# EAGLE design input_wheel (EAGLE 7.3.0)
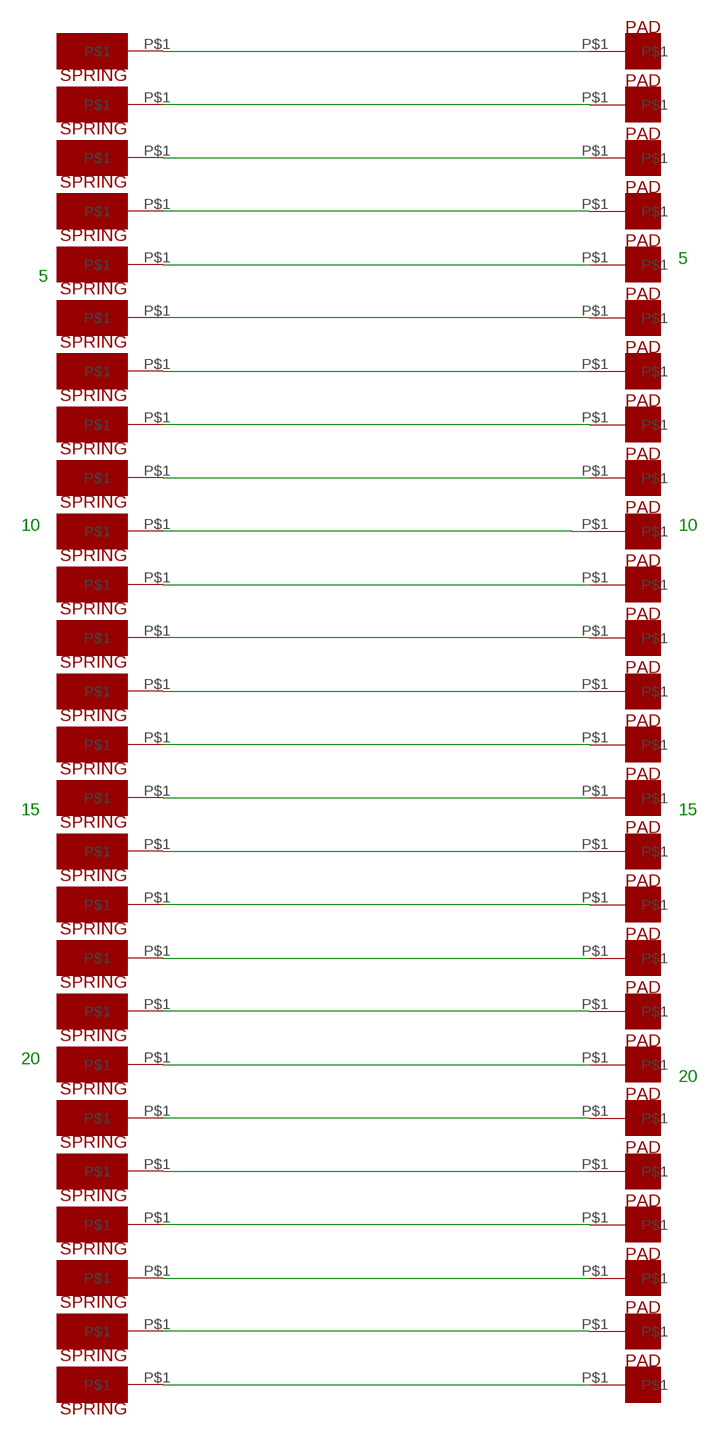
[diagram p0: schematic, sheet 1]

## Parts
U$1  CONTACT  [CONTACT]
U$2  CONTACT  [CONTACT]
U$3  CONTACT  [CONTACT]
U$4  CONTACT  [CONTACT]
U$5  CONTACT  [CONTACT]
U$6  CONTACT  [CONTACT]
U$7  CONTACT  [CONTACT]
U$8  CONTACT  [CONTACT]
U$9  CONTACT  [CONTACT]
U$10  CONTACT  [CONTACT]
U$11  CONTACT  [CONTACT]
U$12  CONTACT  [CONTACT]
U$13  CONTACT  [CONTACT]
U$14  CONTACT  [CONTACT]
U$15  CONTACT  [CONTACT]
U$16  CONTACT  [CONTACT]
U$17  CONTACT  [CONTACT]
U$18  CONTACT  [CONTACT]
U$19  CONTACT  [CONTACT]
U$20  CONTACT  [CONTACT]
U$21  CONTACT  [CONTACT]
U$22  CONTACT  [CONTACT]
U$23  CONTACT  [CONTACT]
U$24  CONTACT  [CONTACT]
U$25  CONTACT  [CONTACT]
U$26  CONTACT  [CONTACT]
U$27  SPRING  [SPRING]
U$28  SPRING  [SPRING]
U$29  SPRING  [SPRING]
U$30  SPRING  [SPRING]
U$31  SPRING  [SPRING]
U$32  SPRING  [SPRING]
U$33  SPRING  [SPRING]
U$34  SPRING  [SPRING]
U$35  SPRING  [SPRING]
U$36  SPRING  [SPRING]
U$37  SPRING  [SPRING]
U$38  SPRING  [SPRING]
U$39  SPRING  [SPRING]
U$40  SPRING  [SPRING]
U$41  SPRING  [SPRING]
U$42  SPRING  [SPRING]
U$43  SPRING  [SPRING]
U$44  SPRING  [SPRING]
U$45  SPRING  [SPRING]
U$46  SPRING  [SPRING]
U$47  SPRING  [SPRING]
U$48  SPRING  [SPRING]
U$49  SPRING  [SPRING]
U$50  SPRING  [SPRING]
U$51  SPRING  [SPRING]
U$52  SPRING  [SPRING]

## Nets
N$1: U$10.P$1 U$36.P$1
N$2: U$1.P$1 U$27.P$1
N$3: U$2.P$1 U$28.P$1
N$4: U$4.P$1 U$30.P$1
N$5: U$11.P$1 U$37.P$1
N$6: U$5.P$1 U$31.P$1
N$7: U$6.P$1 U$32.P$1
N$8: U$7.P$1 U$33.P$1
N$9: U$8.P$1 U$34.P$1
N$10: U$9.P$1 U$35.P$1
N$11: U$12.P$1 U$38.P$1
N$12: U$13.P$1 U$39.P$1
N$13: U$14.P$1 U$40.P$1
N$14: U$15.P$1 U$41.P$1
N$15: U$16.P$1 U$42.P$1
N$16: U$17.P$1 U$43.P$1
N$17: U$18.P$1 U$44.P$1
N$18: U$19.P$1 U$45.P$1
N$19: U$20.P$1 U$46.P$1
N$20: U$21.P$1 U$47.P$1
N$21: U$22.P$1 U$48.P$1
N$22: U$23.P$1 U$49.P$1
N$23: U$24.P$1 U$50.P$1
N$24: U$25.P$1 U$51.P$1
N$25: U$26.P$1 U$52.P$1
N$27: U$3.P$1 U$29.P$1

## Notes on the sheet
- 5
- 5
- 10 | 10
- 15 | 15
- 20
- 20

## Library data of the parts
U$1-U$26 = enigma:CONTACT
U$27-U$52 = enigma:SPRING

## Board
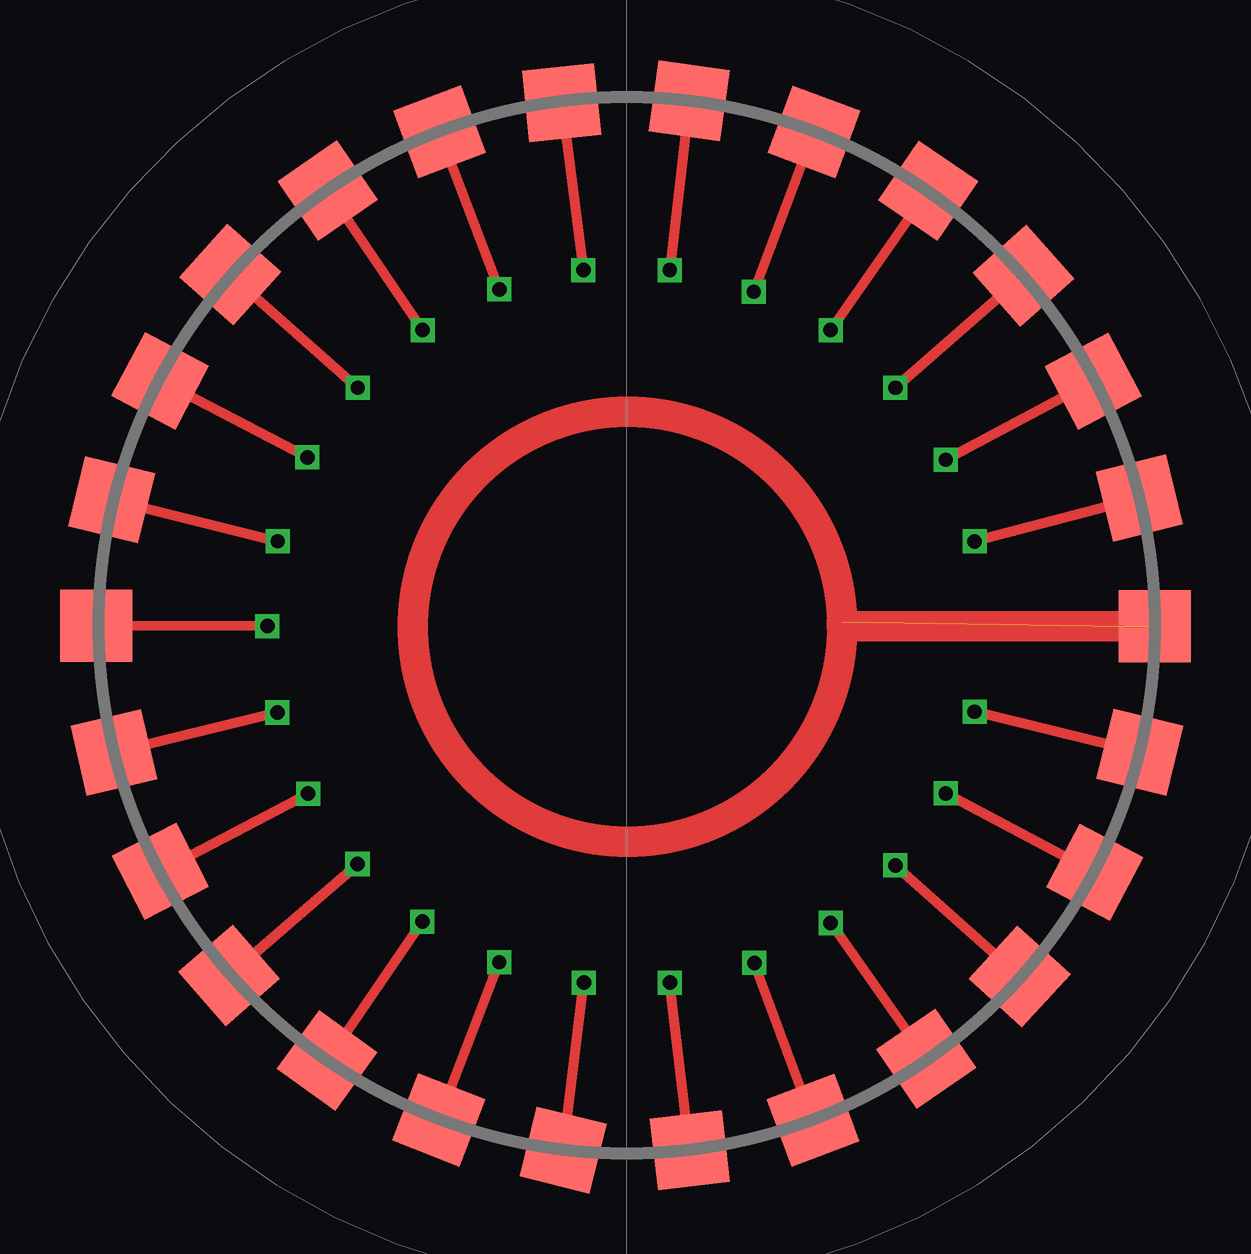
[diagram p1: board, top side]
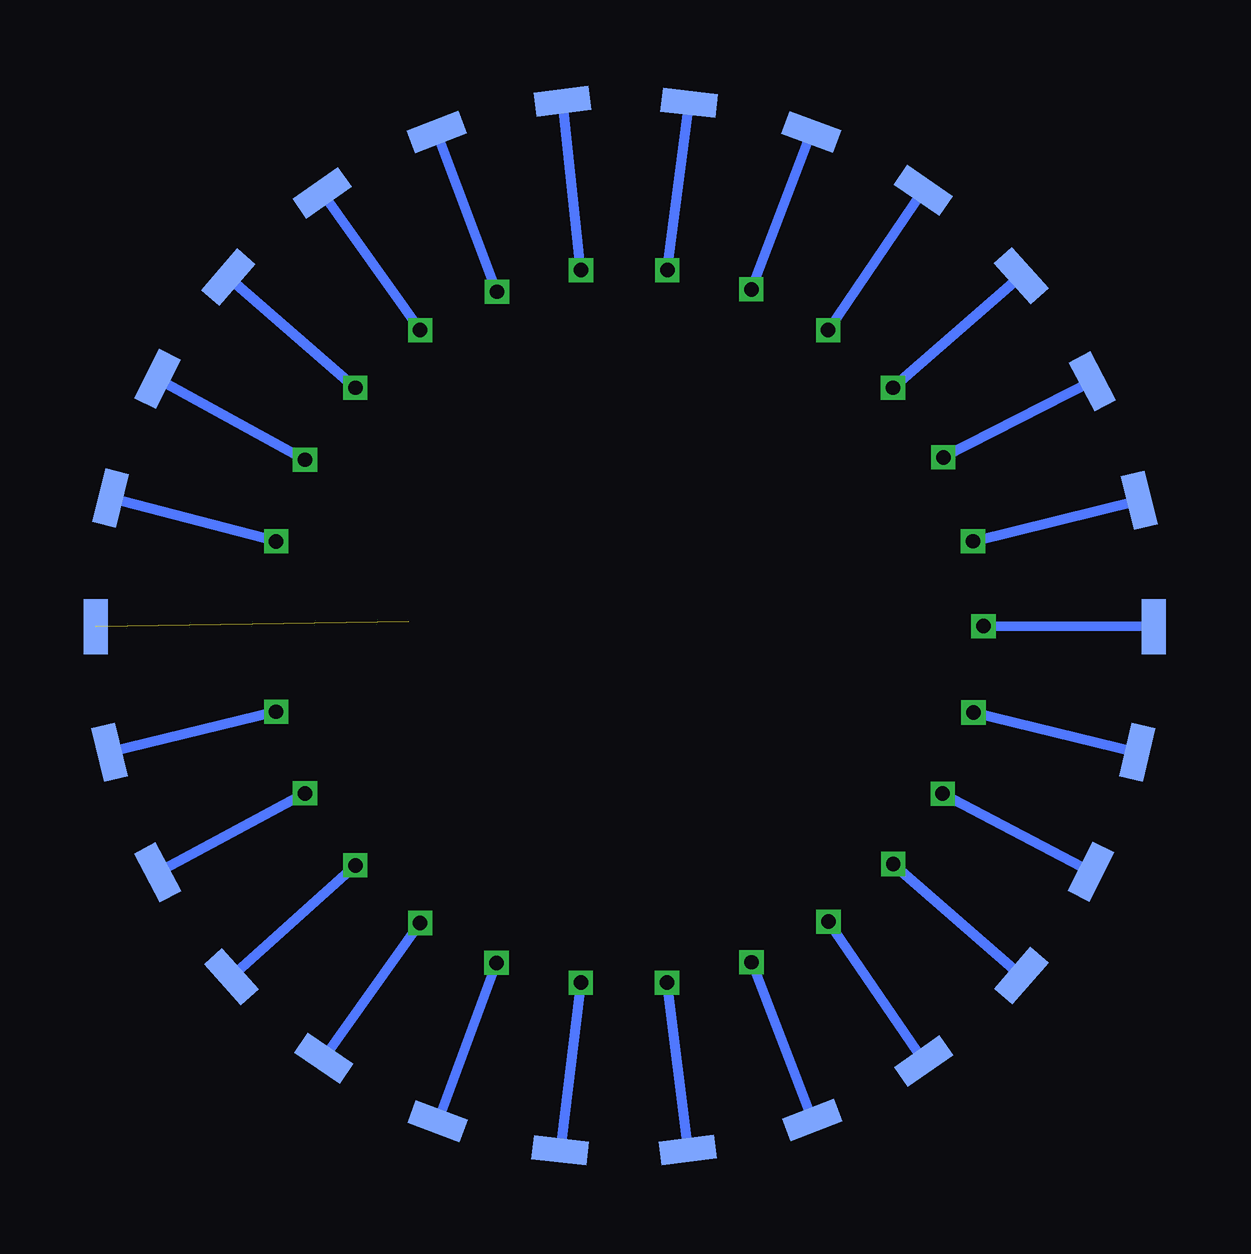
[diagram p2: board, bottom side, seen from below]

No outline drawn. Coordinates in mm, seen from the top.
Copper layers (1*16): Top 0.035mm / dielectric 1.5mm / Bottom 0.035mm
Design rules "default": minimum track width 10mil, minimum drill 24mil, track to track 8mil, track to pad 8mil, pad to pad 8mil, via to via 8mil, smd to smd 8mil, copper to edge 40mil, drill to drill 8mil, minimum pad ring 10mil, minimum via ring 8mil, stop-mask expansion 4mil, vias tented up to drill 0mil, thermal gap 10mil

### Footprints (pad centres in the part's own frame; a part is rotated, then mirrored left to right if it is on the bottom)
CONTACT = smd 3 x 3: P$1 0,0
SPRING = smd 2.3 x 1: P$1 0,0

### Placement (x,y rotation side)
U$1  52.01,29.97 0 top
U$2  51.36,35.31 103.9 top
U$3  49.44,40.18 117.8 top
U$4  46.53,44.57 41.7 top
U$5  42.56,48.11 145.6 top
U$6  37.8,50.56 69.5 top
U$7  7.89,29.98 0 top
U$8  27.29,51.77 95.9 top
U$9  49.51,19.71 332.2 top
U$10  51.38,24.71 346.1 top
U$11  46.38,15.37 137.6 top
U$12  42.48,11.95 304.4 top
U$13  32.64,8.13 276.6 top
U$14  37.77,9.38 290.5 top
U$15  22.17,9.39 248.8 top
U$16  27.36,8.14 346.1 top
U$17  13.44,15.42 221 top
U$18  17.53,11.87 54.2 top
U$19  17.54,48.12 304.4 top
U$20  22.2,50.57 290.5 top
U$21  13.48,44.62 318.3 top
U$22  10.56,40.19 332.2 top
U$23  8.63,24.71 193.2 top
U$24  8.54,35.23 346.1 top
U$25  10.57,19.76 207.1 top
U$26  32.61,51.86 82 top
U$27  52.02,29.95 90 bottom
U$28  51.39,35.31 76.1 bottom
U$29  49.45,40.27 242.9 bottom
U$30  46.5,44.51 229 bottom
U$31  42.59,48.02 215.1 bottom
U$32  37.81,50.56 201.2 bottom
U$33  7.94,29.94 90 bottom
U$34  27.3,51.77 353.4 bottom
U$35  49.44,19.71 117.8 bottom
U$36  51.45,24.71 103.9 bottom
U$37  46.37,15.36 131.7 bottom
U$38  42.52,11.96 145.6 bottom
U$39  32.67,8.13 173.4 bottom
U$40  37.78,9.34 159.5 bottom
U$41  22.16,9.39 201.2 bottom
U$42  27.35,8.14 187.3 bottom
U$43  13.45,15.41 229 bottom
U$44  17.53,11.85 215.1 bottom
U$45  17.54,48.12 145.6 bottom
U$46  22.21,50.56 159.5 bottom
U$47  13.46,44.57 131.7 bottom
U$48  10.5,40.17 117.8 bottom
U$49  8.62,24.71 256.8 bottom
U$50  8.54,35.22 103.9 bottom
U$51  10.55,19.74 242.9 bottom
U$52  32.57,51.84 187.3 bottom

### Tracks (layer width: path | path; a pad name or v marks a point on that pad's centre or on a via)
N$1  (via drill 0.6)
  Top 0.406: U$10.P$1 v44.5,26.4
  Bottom 0.406: v44.5,26.4 U$36.P$1
N$2  (2 unrouted)
  Top 1.27: U$1.P$1 38.97,29.97 38.97,30.15
N$3  (via drill 0.6)
  Top 0.406: U$2.P$1 v44.5,33.5
  Bottom 0.406: v44.5,33.5 U$28.P$1
N$4  (via drill 0.6)
  Top 0.406: v41.2,39.9 U$4.P$1
  Bottom 0.406: U$30.P$1 v41.2,39.9
N$5  (via drill 0.6)
  Top 0.406: U$11.P$1 v41.2,20
  Bottom 0.406: v41.2,20 U$37.P$1
N$6  (via drill 0.6)
  Top 0.406: v38.5,42.3 U$5.P$1
  Bottom 0.406: U$31.P$1 v38.5,42.3
N$7  (via drill 0.6)
  Top 0.406: U$6.P$1 v35.3,43.9
  Bottom 0.406: v35.3,43.9 U$32.P$1
N$8  (via drill 0.6)
  Top 0.406: v15.03,29.97 U$7.P$1
  Bottom 0.406: U$33.P$1 v15.03,29.97
N$9  (via drill 0.6)
  Top 0.406: U$8.P$1 v28.2,44.8
  Bottom 0.406: v28.2,44.8 U$34.P$1
N$10  (via drill 0.6)
  Top 0.406: v43.3,23 U$9.P$1
  Bottom 0.406: U$35.P$1 v43.3,23
N$11  (via drill 0.6)
  Top 0.406: v38.5,17.6 U$12.P$1
  Bottom 0.406: U$38.P$1 v38.5,17.6
N$12  (via drill 0.6)
  Top 0.406: U$13.P$1 v31.8,15.12
  Bottom 0.406: v31.8,15.12 U$39.P$1
N$13  (via drill 0.6)
  Top 0.406: U$14.P$1 v35.32,15.94
  Bottom 0.406: v35.32,15.94 U$40.P$1
N$14  (via drill 0.6)
  Top 0.406: U$15.P$1 v24.69,15.96
  Bottom 0.406: v24.69,15.96 U$41.P$1
N$15  (via drill 0.6)
  Top 0.406: U$16.P$1 v28.22,15.12
  Bottom 0.406: v28.22,15.12 U$42.P$1
N$16  (via drill 0.6)
  Top 0.406: U$17.P$1 v18.79,20.06
  Bottom 0.406: v18.79,20.06 U$43.P$1
N$17  (via drill 0.6)
  Top 0.406: U$18.P$1 v21.49,17.66
  Bottom 0.406: v21.49,17.66 U$44.P$1
N$18  (via drill 0.6)
  Top 0.406: v21.5,42.3 U$45.P$1
  Bottom 0.406: U$45.P$1 v21.5,42.3
N$19  (via drill 0.6)
  Top 0.406: v24.7,44 U$20.P$1
  Bottom 0.406: U$46.P$1 v24.7,44
N$20  (via drill 0.6)
  Top 0.406: v18.8,39.9 U$21.P$1
  Bottom 0.406: U$47.P$1 v18.8,39.9
N$21  (via drill 0.6)
  Top 0.406: v16.7,37 U$22.P$1
  Bottom 0.406: U$48.P$1 v16.7,37
N$22  (via drill 0.6)
  Top 0.406: U$23.P$1 v15.45,26.37
  Bottom 0.406: v15.45,26.37 U$49.P$1
N$23  (via drill 0.6)
  Top 0.406: U$24.P$1 v15.47,33.51
  Bottom 0.406: v15.47,33.51 U$50.P$1
N$24  (via drill 0.6)
  Top 0.406: U$25.P$1 v16.73,22.99
  Bottom 0.406: v16.73,22.99 U$51.P$1
N$25  (via drill 0.6)
  Top 0.406: U$26.P$1 v31.8,44.8
  Bottom 0.406: v31.8,44.8 U$52.P$1
N$27  (via drill 0.6)
  Top 0.406: U$3.P$1 v43.3,36.9
  Bottom 0.406: v43.3,36.9 U$29.P$1
(copper drawn outside any net)
  shapes: Top circle x1